# Altium project LitosConnector.PrjPcb
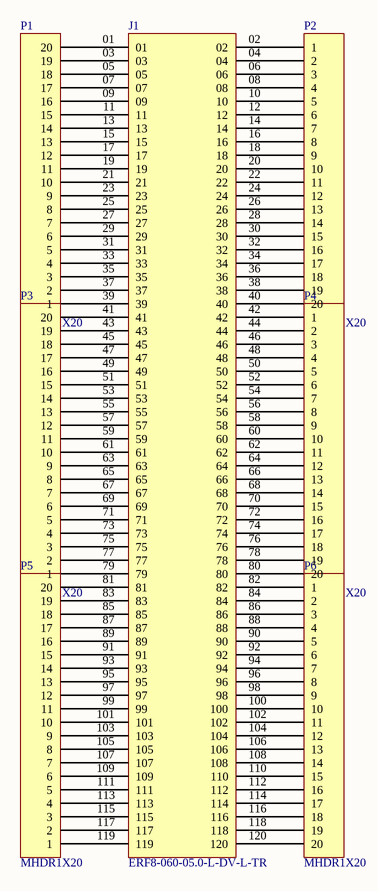
[diagram p0: LitosConnector.SchDoc]
1 sheet, 7 parts. Net scope: global (net labels, ports and power ports of the same name join across sheets).
Board file: LitosConnector.PcbDoc

## Sheet LitosConnector.SchDoc
size A; SheetNumber: 1; SheetTotal: 1

### Parts
J1  ERF8-060-05.0-L-DV-L-TR  [SAMTEC_ERF8-060-05.0-L-DV-L-TR]
P1  MHDR1X20  [MHDR1X20]
P2  MHDR1X20  [MHDR1X20]
P3  MHDR1X20  [MHDR1X20]
P4  MHDR1X20  [MHDR1X20]
P5  MHDR1X20  [MHDR1X20]
P6  MHDR1X20  [MHDR1X20]

### Nets
NetJ1_01: J1.01 P1.20
NetJ1_02: J1.02 P2.1
NetJ1_03: J1.03 P1.19
NetJ1_04: J1.04 P2.2
NetJ1_05: J1.05 P1.18
NetJ1_06: J1.06 P2.3
NetJ1_07: J1.07 P1.17
NetJ1_08: J1.08 P2.4
NetJ1_09: J1.09 P1.16
NetJ1_10: J1.10 P2.5
NetJ1_11: J1.11 P1.15
NetJ1_12: J1.12 P2.6
NetJ1_13: J1.13 P1.14
NetJ1_14: J1.14 P2.7
NetJ1_15: J1.15 P1.13
NetJ1_16: J1.16 P2.8
NetJ1_17: J1.17 P1.12
NetJ1_18: J1.18 P2.9
NetJ1_19: J1.19 P1.11
NetJ1_20: J1.20 P2.10
NetJ1_21: J1.21 P1.10
NetJ1_22: J1.22 P2.11
NetJ1_23: J1.23 P1.9
NetJ1_24: J1.24 P2.12
NetJ1_25: J1.25 P1.8
NetJ1_26: J1.26 P2.13
NetJ1_27: J1.27 P1.7
NetJ1_28: J1.28 P2.14
NetJ1_29: J1.29 P1.6
NetJ1_30: J1.30 P2.15
NetJ1_31: J1.31 P1.5
NetJ1_32: J1.32 P2.16
NetJ1_33: J1.33 P1.4
NetJ1_34: J1.34 P2.17
NetJ1_35: J1.35 P1.3
NetJ1_36: J1.36 P2.18
NetJ1_37: J1.37 P1.2
NetJ1_38: J1.38 P2.19
NetJ1_39: J1.39 P1.1
NetJ1_40: J1.40 P2.20
NetJ1_41: J1.41 P3.20
NetJ1_42: J1.42 P4.1
NetJ1_43: J1.43 P3.19
NetJ1_44: J1.44 P4.2
NetJ1_45: J1.45 P3.18
NetJ1_46: J1.46 P4.3
NetJ1_47: J1.47 P3.17
NetJ1_48: J1.48 P4.4
NetJ1_49: J1.49 P3.16
NetJ1_50: J1.50 P4.5
NetJ1_51: J1.51 P3.15
NetJ1_52: J1.52 P4.6
NetJ1_53: J1.53 P3.14
NetJ1_54: J1.54 P4.7
NetJ1_55: J1.55 P3.13
NetJ1_56: J1.56 P4.8
NetJ1_57: J1.57 P3.12
NetJ1_58: J1.58 P4.9
NetJ1_59: J1.59 P3.11
NetJ1_60: J1.60 P4.10
NetJ1_61: J1.61 P3.10
NetJ1_62: J1.62 P4.11
NetJ1_63: J1.63 P3.9
NetJ1_64: J1.64 P4.12
NetJ1_65: J1.65 P3.8
NetJ1_66: J1.66 P4.13
NetJ1_67: J1.67 P3.7
NetJ1_68: J1.68 P4.14
NetJ1_69: J1.69 P3.6
NetJ1_70: J1.70 P4.15
NetJ1_71: J1.71 P3.5
NetJ1_72: J1.72 P4.16
NetJ1_73: J1.73 P3.4
NetJ1_74: J1.74 P4.17
NetJ1_75: J1.75 P3.3
NetJ1_76: J1.76 P4.18
NetJ1_77: J1.77 P3.2
NetJ1_78: J1.78 P4.19
NetJ1_79: J1.79 P3.1
NetJ1_80: J1.80 P4.20
NetJ1_81: J1.81 P5.20
NetJ1_82: J1.82 P6.1
NetJ1_83: J1.83 P5.19
NetJ1_84: J1.84 P6.2
NetJ1_85: J1.85 P5.18
NetJ1_86: J1.86 P6.3
NetJ1_87: J1.87 P5.17
NetJ1_88: J1.88 P6.4
NetJ1_89: J1.89 P5.16
NetJ1_90: J1.90 P6.5
NetJ1_91: J1.91 P5.15
NetJ1_92: J1.92 P6.6
NetJ1_93: J1.93 P5.14
NetJ1_94: J1.94 P6.7
NetJ1_95: J1.95 P5.13
NetJ1_96: J1.96 P6.8
NetJ1_97: J1.97 P5.12
NetJ1_98: J1.98 P6.9
NetJ1_99: J1.99 P5.11
NetJ1_100: J1.100 P6.10
NetJ1_101: J1.101 P5.10
NetJ1_102: J1.102 P6.11
NetJ1_103: J1.103 P5.9
NetJ1_104: J1.104 P6.12
NetJ1_105: J1.105 P5.8
NetJ1_106: J1.106 P6.13
NetJ1_107: J1.107 P5.7
NetJ1_108: J1.108 P6.14
NetJ1_109: J1.109 P5.6
NetJ1_110: J1.110 P6.15
NetJ1_111: J1.111 P5.5
NetJ1_112: J1.112 P6.16
NetJ1_113: J1.113 P5.4
NetJ1_114: J1.114 P6.17
NetJ1_115: J1.115 P5.3
NetJ1_116: J1.116 P6.18
NetJ1_117: J1.117 P5.2
NetJ1_118: J1.118 P6.19
NetJ1_119: J1.119 P5.1
NetJ1_120: J1.120 P6.20

### Library data of the parts
P1-P6 = MHDR1X20: Header, 20-Pin; LatestRevisionDate: 17-Jul-2002; LatestRevisionNote: Re-released for DXP Platform.; Publisher: Altium Limited